# Altium project Gateway_ESP32.PrjPcb
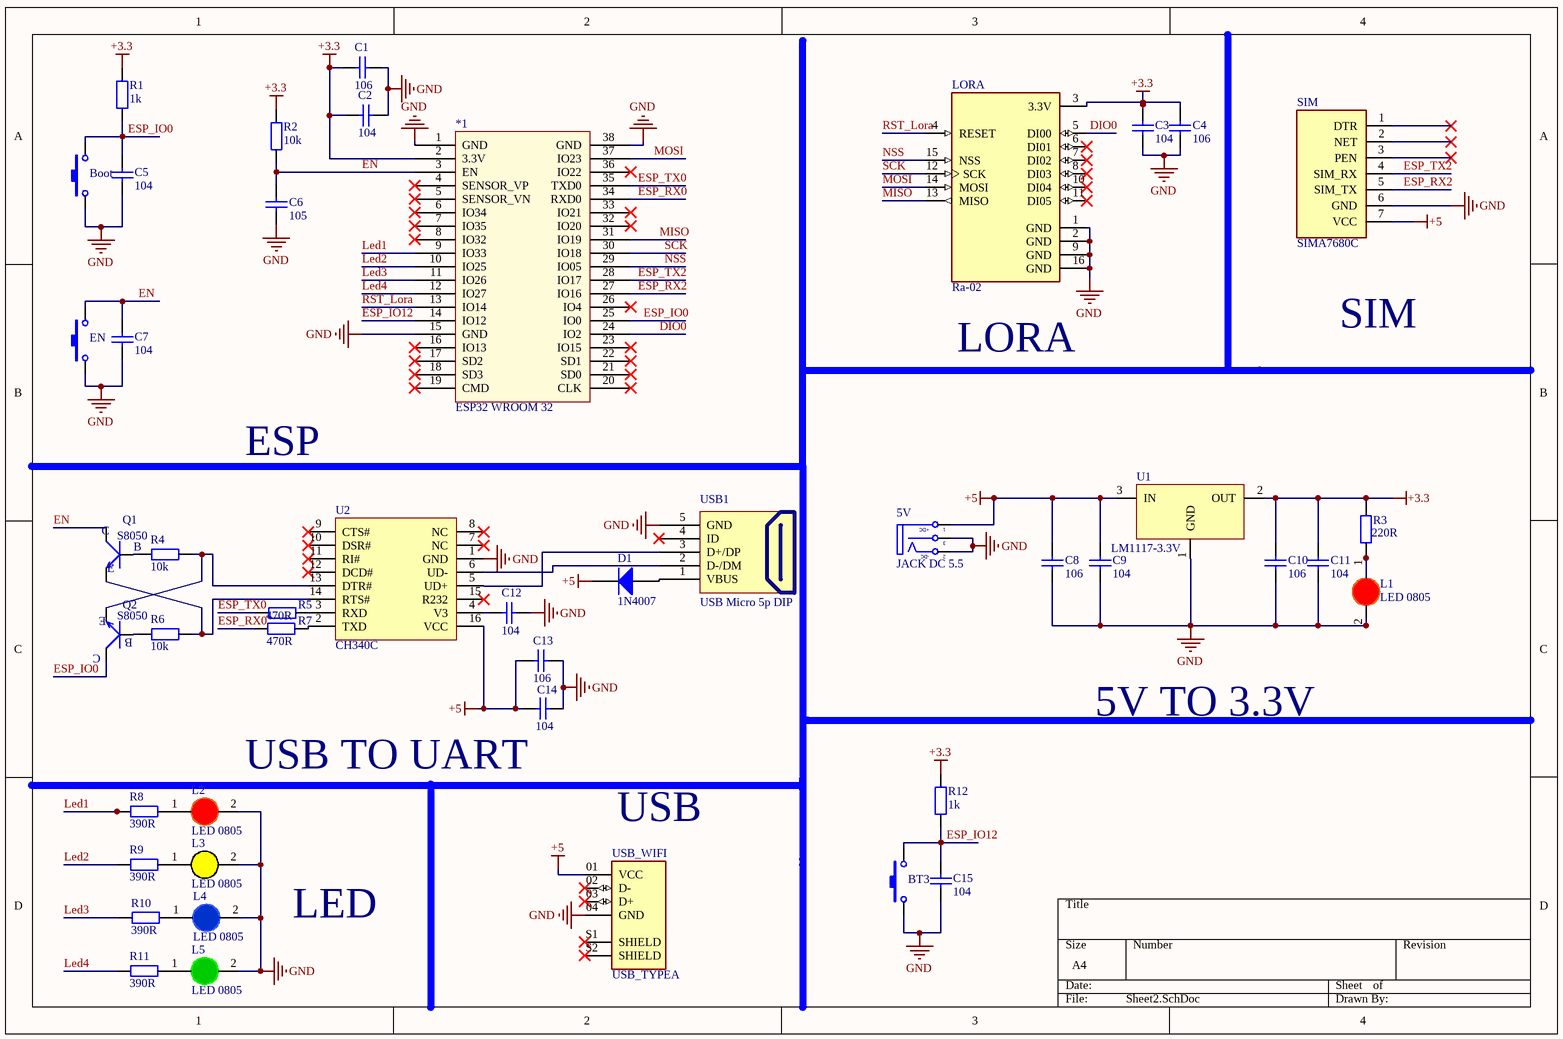
[diagram p0: Sheet2.SchDoc]
1 sheet, 46 parts. Net scope: global (net labels, ports and power ports of the same name join across sheets).
Board file: PCB2.PcbDoc

## Sheet Sheet2.SchDoc
size A4; SheetNumber: 1; SheetTotal: 1

### Parts
5V  JACK DC 5.5  [JACK DC 5.5]
*1  ESP32 WROOM 32  [ESP32-WROOM-32D]
Boot  Nut Nhan 2 Chan SMD 3x6x2.5  [Nut Nhan 2 Chan SMD 3x6x2.5]  (value not drawn)
BT3  Nut Nhan 2 Chan SMD 3x6x2.5  [Nut Nhan 2 Chan SMD 3x6x2.5]  (value not drawn)
C1  106  [tu 1206]
C2  104  [tu 1206]
C3  104  [tu 1206]
C4  106  [tu 1206]
C5  104  [tu 1206]
C6  105  [tu 1206]
C7  104  [tu 1206]
C8  106  [tu 1206]
C9  104  [tu 1206]
C10  106  [tu 1206]
C11  104  [tu 1206]
C12  104  [tu 1206]
C13  106  [tu 1206]
C14  104  [tu 1206]
C15  104  [tu 1206]
D1  1N4007  [DIODE SMA]
EN  Nut Nhan 2 Chan SMD 3x6x2.5  [Nut Nhan 2 Chan SMD 3x6x2.5]  (value not drawn)
L1  LED 0805  [LED-1206-Red]
L2  LED 0805  [LED-1206-Red]
L3  LED 0805  [LED-1206-Yellow]
L4  LED 0805  [LED-1206-Blue]
L5  LED 0805  [LED-1206-Green]
LORA  Ra-02  [Sx1278]
Q1  S8050  [S8050]
Q2  S8050  [S8050]
R1  1k  [tro smd 1206]
R2  10k  [tro smd 1206]
R3  220R  [tro smd 1206]
R4  10k  [tro smd 1206]
R5  470R  [tro smd 1206]
R6  10k  [tro smd 1206]
R7  470R  [tro smd 1206]
R8  390R  [Tro smd 1206]
R9  390R  [Tro smd 1206]
R10  390R  [Tro smd 1206]
R11  390R  [Tro smd 1206]
R12  1k  [tro smd 1206]
SIM  SIMA7680C  [SIMA7680C]
U1  LM1117-3.3V  [SOT223]
U2  CH340C  [SOIC16_50_284_25X90_SMT]
USB1  USB Micro 5p DIP  [USB Micro 5p DIP]
USB_WIFI  USB_TYPEA  [USB_TYPEA]

### Nets
+3.3: *1.2(3.3V) C1.2 C2.2 C3.1 C4.1 C10.1 C11.1 LORA.3(3.3V) R1.2 R2.2 R3.2 R12.2 U1.2(OUT)
+5: 5V.1(T) C8.1 C9.1 C13.1 C14.1 D1.2(K) SIM.7(VCC) U1.3(IN) U2.16(VCC) USB_WIFI.01(VCC)
GND: 5V.2(TN) 5V.3(S) *1.1(GND) *1.15(GND) *1.38(GND) Boot.1 BT3.1 C1.1 C2.1 C3.2 C4.2 C5.2 C6.2 C7.2 C8.2 C9.2 C10.2 C11.2 C12.2 C13.2 C14.2 C15.2 EN.1 L1.2(K) L2.2(K) L3.2(K) L4.2(K) L5.2(K) LORA.1(GND) LORA.2(GND) LORA.9(GND) LORA.16(GND) SIM.6(GND) U1.1(GND) U2.1(GND) USB1.5(GND) USB_WIFI.04(GND)
DIO0: *1.24(IO2) LORA.5(DI00)
EN: *1.3(EN) C6.1 C7.1 EN.2 Q1.3(C) R2.1
ESP_IO0: *1.25(IO0) Boot.2 C5.1 Q2.3(C) R1.1
ESP_IO12: *1.14(IO12) BT3.2 C15.1 R12.1
ESP_RX0: *1.34(RXD0) R7.1
ESP_RX2: *1.27(IO16) SIM.5(SIM_TX)
ESP_TX0: *1.35(TXD0) R5.1
ESP_TX2: *1.28(IO17) SIM.4(SIM_RX)
Led1: *1.9(IO33) R8.2
Led2: *1.10(IO25) R9.2
Led3: *1.11(IO26) R10.2
Led4: *1.12(IO27) R11.2
MISO: *1.31(IO19) LORA.13(MISO)
MOSI: *1.37(IO23) LORA.14(MOSI)
NSS: *1.29(IO05) LORA.15(NSS)
RST_Lora: *1.13(IO14) LORA.4(RESET)
SCK: *1.30(IO18) LORA.12(SCK)
NetC12_1: C12.1 U2.4(V3)
NetD1_1: D1.1(A) USB1.1(VBUS)
NetL1_1: L1.1(A) R3.1
NetL2_1: L2.1(A) R8.1
NetL3_1: L3.1(A) R9.1
NetL4_1: L4.1(A) R10.1
NetL5_1: L5.1(A) R11.1
NetQ1_1: Q1.1(B) R4.1
NetQ1_2: Q1.2(E) R6.2 U2.14(RTS#)
NetQ2_1: Q2.1(B) R6.1
NetQ2_2: Q2.2(E) R4.2 U2.13(DTR#)
NetR5_2: R5.2 U2.3(RXD)
NetR7_2: R7.2 U2.2(TXD)
NetU2_5: U2.5(UD+) USB1.3(D+/DP)
NetU2_6: U2.6(UD-) USB1.2(D-/DM)

Not connected (* = marked no-connect by the designer): *1 4(SENSOR_VP)* 5(SENSOR_VN)* 6(IO34)* 7(IO35)* 8(IO32)* 16(IO13)* 17(SD2)* 18(SD3)* 19(CMD)* 20(CLK)* 21(SD0)* 22(SD1)* 23(IO15)* 26(IO4)* 32(IO20)* 33(IO21)* 36(IO22)*; LORA 6(DI01)* 7(DI02)* 8(DI03)* 10(DI04)* 11(DI05)*; SIM 1(DTR)* 2(NET)* 3(PEN)*; U2 7(NC)* 8(NC)* 9(CTS#)* 10(DSR#)* 11(RI#)* 12(DCD#)* 15(R232)*; USB1 4(ID)*; USB_WIFI 02(D-)* 03(D+)* S1(SHIELD)* S2(SHIELD)*

### Notes on the sheet
- (near LORA) LORA
- SIM
- ESP
- 5V TO 3.3V
- USB TO UART
- (near USB_WIFI) USB
- LED
- (in symbol JACK DC 5.5) +DC; -DC

### Library data of the parts
5V = JACK DC 5.5: Value: Jac DC
Boot BT3 EN = Nut Nhan 2 Chan SMD 3x6x2.5: Ma_Hang: MH001036; Ten: Nút Nhấn 2 Chân 3x6x2.5MM SMD
C1 C4 C8 C10 C13 = Tu 1206 106 16V 20%: Dán; Don_Vi: Con; So_Chan: 2; Ten_Linh_Kien: Tụ 1206 106-10uF 20% 16V; Ma_Hang: MH004541; Chung_Loai: Dán; Kieu_Chan: *
C2 C3 C5 C7 C9 C11 C12 C14 C15 = Tu 1206 104 50V 20%: Dán; Don_Vi: Con; So_Chan: 2; Ten_Linh_Kien: Tụ 1206 104-0.1uF 20% 50V; Ma_Hang: MH004544; Chung_Loai: Dán; Kieu_Chan: *
C6 = Tu 1206 105 50V 20%: Dán; Don_Vi: Con; So_Chan: 2; Ten_Linh_Kien: Tụ 1206 105-1uF 20% 50V; Ma_Hang: MH004545; Chung_Loai: Dán; Kieu_Chan: *
D1 = Diode M7 ( 4007 ): Dán; Don_Vi: Con; Ten_Linh_Kien: Diode M7 1N4007 SMD 1A 1000V; Ma_Hang: MH000944; Chung_Loai: Dán; Ghi_Chu: *
L1 L2 = LED 1206 Do: Dán; Don_Vi: Con; Ma_Hang: MH002334; Ten_Linh_Kien: LED1206 Màu Đỏ (Red); Ghi_Chu: *; Kieu_Chan: *; Chung_Loai: Dán
L3 = LED 1206 Vang: Dán; Don_Vi: Con; Ma_Hang: MH002331; Ten_Linh_Kien: LED1206 Màu Vàng (Yellow); Ghi_Chu: *; Kieu_Chan: *; Chung_Loai: Dán
L4 = LED 1206 Xanh Duong: Dán; Don_Vi: Con; Ma_Hang: MH002333; Ten_Linh_Kien: LED1206 Màu Xanh Dương (Blue); Ghi_Chu: *; Kieu_Chan: *; Chung_Loai: Dán
L5 = LED 1206 Xanh La: Dán; Don_Vi: Con; Ma_Hang: MH002947; Ten_Linh_Kien: LED1206 Màu Xanh Lá (Green); Ghi_Chu: *; Kieu_Chan: *; Chung_Loai: Dán
LORA = Ra-02: Lora sx1278
Q1 Q2 = S8050: Transistor NPN
R1 R12 = Tro 1206 5% 1k: Dán; Don_Vi: Con; So_Chan: 2; Ten_Linh_Kien: Trở 1206 5% 1k; Ma_Hang: MH005904; Chung_Loai: Dán; Kieu_Chan: *
R2 = Tro 1206 1% 10k: Dán; Don_Vi: Con; So_Chan: 2; Ten_Linh_Kien: Trở 1206 1% 10k; Ma_Hang: MH005885; Chung_Loai: Dán; Kieu_Chan: *
R3 = Tro 1206 1% 220R: Dán; Ma_Hang: MH005897; Don_Vi: Con; So_Chan: 2; Ten_Linh_Kien: Trở 1206 1% 220R; Chung_Loai: Dán; Kieu_Chan: *
R4 R6 = Tro 1206 5% 10k: Dán; Don_Vi: Con; So_Chan: 2; Ten_Linh_Kien: Trở 1206 5% 10K; Ma_Hang: MH005909; Chung_Loai: Dán; Kieu_Chan: *
R5 R7 = Tro 1206 1% 680R: Dán; Don_Vi: Con; So_Chan: 2; Ten_Linh_Kien: Trở 1206 5% 680R; Ma_Hang: MH005901; Chung_Loai: Dán; Kieu_Chan: *
R8-R11 = Tro 1206 5% 390R: Dán; Don_Vi: Con; So_Chan: 2; Ten_Linh_Kien: Trở 1206 5% 390R; Ma_Hang: MH005927; Chung_Loai: Dán; Kieu_Chan: *
U1 = LM1117: 800mA Low-Dropout Linear Regulator; Creator: Nguyen Ba Bien; Website: http://group3i.net
U2 = CH340C: USB Bridge, USB to UART USB 2.0 UART Interface; Manufacturer: Olimex; Alternate Part Number-1: NA; Manufacturer Part Number: CH340C; Case/Package: SOIC16; Supplier-1: LCSC; Supplier Part Number-1: C84681
USB1 = USB Micro 5p DIP: USB Type B; Ten: MicroUSB MK5P DIP; Ma_Hang: MH005145